# Altium schematic sheet fek-ledek.SchDoc
size A
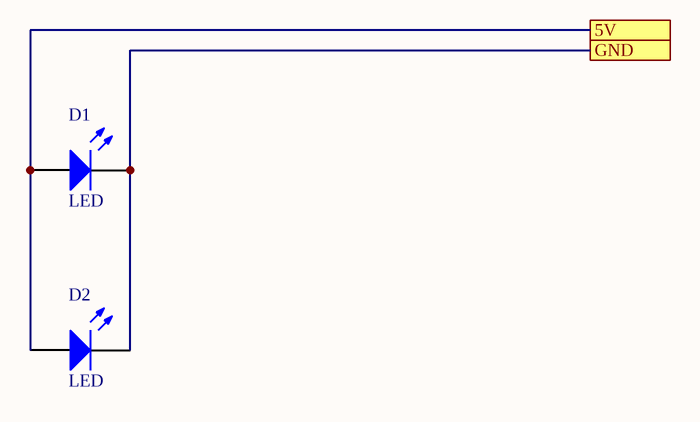
[diagram p0: fek-ledek.SchDoc]

## Parts
D1  LED  [FP_LED_TH_RED]
D2  LED  [FP_LED_TH_RED]

## Ports
5V, GND

## Nets
5V: D1.1(A) D2.1(A) ; port 5V
GND: D1.2(K) D2.2(K) ; port GND

## Library data of the parts
D1 D2 = LED: Typical RED GaAs LED; pin to pad: 1>A 2>K